# EAGLE design PCB eagle project (EAGLE 7.7.0)
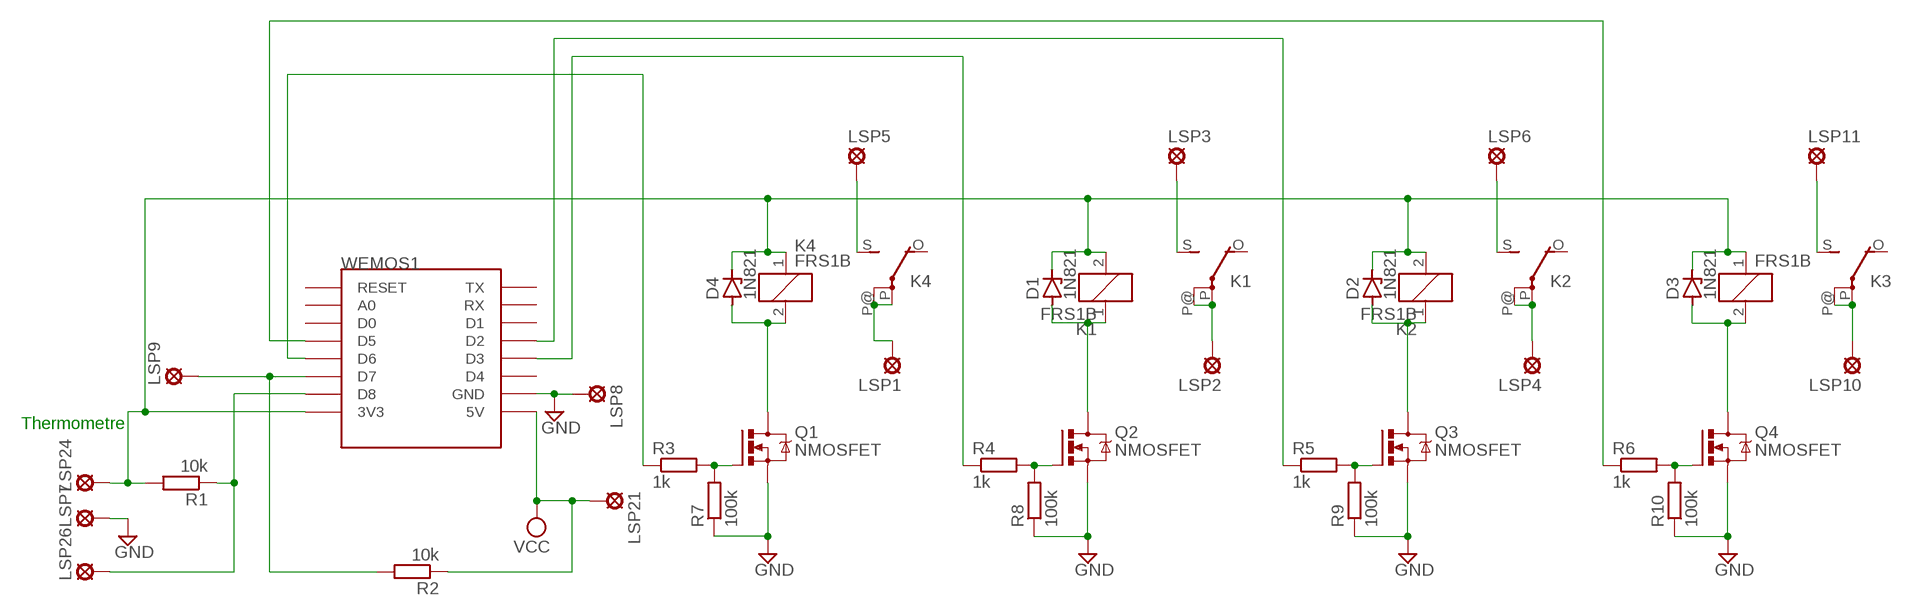
[diagram p0: schematic, sheet 1]

## Parts
D1  1N821  [DO35Z10]
D2  1N821  [DO35Z10]
D3  1N821  [DO35Z10]
D4  1N821  [DO35Z10]
K1  FRS1B  [FRS1B]
K2  FRS1B  [FRS1B]
K3  FRS1B  [FRS1B]
K4  FRS1B  [FRS1B]
LSP1  MCS10B  [MCS10B]
LSP2  MCS10B  [MCS10B]
LSP3  MCS10B  [MCS10B]
LSP4  MCS10B  [MCS10B]
LSP5  MCS10B  [MCS10B]
LSP6  MCS10B  [MCS10B]
LSP7  MCS10B  [MCS10B]
LSP8  MCS10B  [MCS10B]
LSP9  MCS10B  [MCS10B]
LSP10  MCS10B  [MCS10B]
LSP11  MCS10B  [MCS10B]
LSP21  MCS10B  [MCS10B]
LSP24  MCS10B  [MCS10B]
LSP26  MCS10B  [MCS10B]
Q1  NMOSFET  NMOSFETSOT23-GSD  [SOT23]
Q2  NMOSFET  NMOSFETSOT23-GSD  [SOT23]
Q3  NMOSFET  NMOSFETSOT23-GSD  [SOT23]
Q4  NMOSFET  NMOSFETSOT23-GSD  [SOT23]
R1  10k  R-EU_0207/10  [0207/10]
R2  10k  R-EU_0207/10  [0207/10]
R3  1k  R-EU_0207/10  [0207/10]
R4  1k  R-EU_0207/10  [0207/10]
R5  1k  R-EU_0207/10  [0207/10]
R6  1k  R-EU_0207/10  [0207/10]
R7  100k  R-EU_0207/10  [0207/10]
R8  100k  R-EU_0207/10  [0207/10]
R9  100k  R-EU_0207/10  [0207/10]
R10  100k  R-EU_0207/10  [0207/10]
WEMOS1  ui  WEMOS-D1-MINI  [WEMOS-D1-MINI]

## Nets
GND: LSP7.MP LSP8.MP Q1.2(S) Q2.2(S) Q3.2(S) Q4.2(S) R7.1 R8.1 R9.1 R10.1 WEMOS1.GND
N$1: K4.S(2:S) LSP5.MP
N$3: K3.S(2:S) LSP11.MP
N$4: K1.S(2:S) LSP3.MP
N$5: K4.P(2:P) K4.P@(2:P) LSP1.MP
N$7: K1.P(2:P) K1.P@(2:P) LSP2.MP
N$8: LSP26.MP R1.1 WEMOS1.D8
N$10: K2.S(2:S) LSP6.MP
N$11: LSP9.MP R2.2 WEMOS1.D7
N$12: K2.P(2:P) K2.P@(2:P) LSP4.MP
N$13: K3.P(2:P) K3.P@(2:P) LSP10.MP
N$15: D1.C D2.C D3.C D4.C K1.2 K2.2 K3.1 K4.1 LSP24.MP R1.2 WEMOS1.3V3
N$16: D4.A K4.2 Q1.3(D)
N$18: D1.A K1.1 Q2.3(D)
N$19: D2.A K2.1 Q3.3(D)
N$20: D3.A K3.2 Q4.3(D)
N$21: Q1.1(G) R3.2 R7.2
N$23: Q2.1(G) R4.2 R8.2
N$24: Q3.1(G) R5.2 R9.2
N$25: Q4.1(G) R6.2 R10.2
N$26: R3.1 WEMOS1.D6
N$27: R4.1 WEMOS1.D3
N$28: R5.1 WEMOS1.D2
N$29: R6.1 WEMOS1.D5
VCC: LSP21.MP R2.1 WEMOS1.5V
Unconnected: K1.O(2:O) K2.O(2:O) K3.O(2:O) K4.O(2:O) WEMOS1.A0 WEMOS1.D0 WEMOS1.D1 WEMOS1.D4 WEMOS1.RESET WEMOS1.RX WEMOS1.TX

## Notes on the sheet
- Thermometre

## Library data of the parts
D1-D4 = diode:1N821: Reference DIODE temperature compensated, 6,2 V
K1-K4 = relay:FRS1B: RELAY 1 x switch, same as V23101-D6-A201, Siemens; OC_FARNELL: unknown; OC_NEWARK: unknown
LSP1-LSP11 LSP21 LSP24 LSP26 = solpad_gropad:MCS10B: SOLDER PAD MC S1, distributor Buerklin, 15F505
Q1-Q4 = Transistor:NMOSFET: N-Channel MOSFET - Generic; CATEGORY: Transistor; SUB-CATEGORY: MOSFET; TYPE: N-Channel
R1-R10 = rcl_gropad:R-EU_: RESISTOR, European symbol; SPICEPREFIX: R
WEMOS1 = esp8266modules:WEMOS-D1-MINI: WeMos.cc D1 mini ESP8266 module

## Net classes
0 default: clearance 0.205 mm

## Board
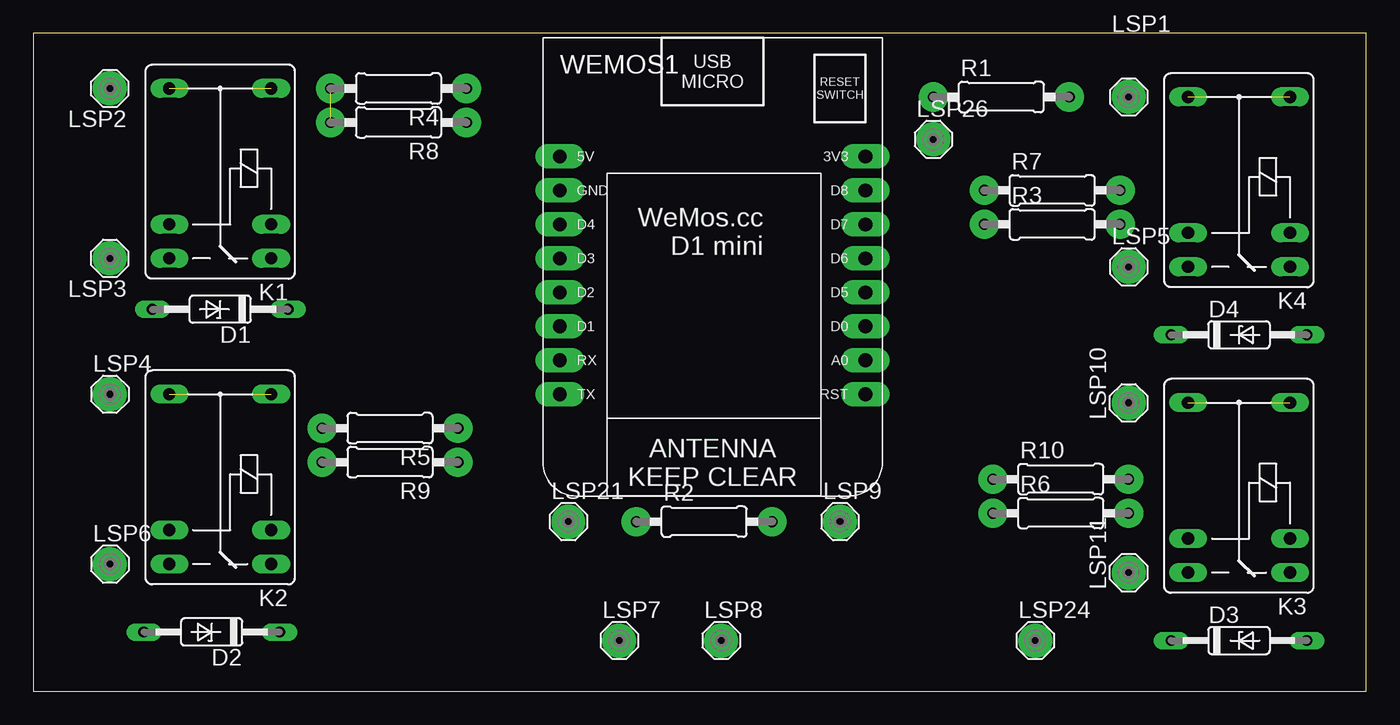
[diagram p1: board, top side]
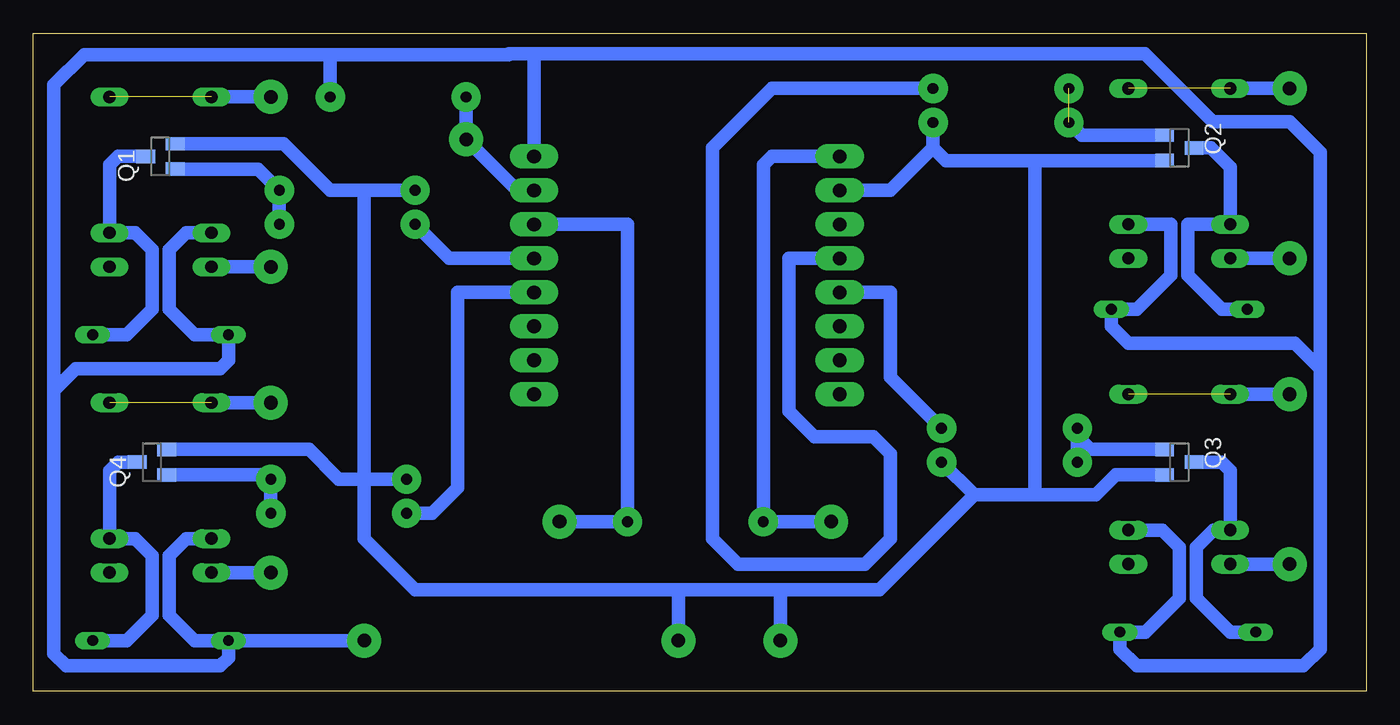
[diagram p2: board, bottom side, seen from below]

Size 99.67 x 49.2 mm. Coordinates in mm from the lower left corner, seen from the top.
Outline: 0,0 99.67,0 99.67,49.2 0,49.2 0,0
Copper layers (1*16): Top 0.035mm / dielectric 1.5mm / Bottom 0.035mm
Design rules "default": minimum track width 6mil, minimum drill 0.35mm, track to track 6mil, track to pad 6mil, pad to pad 6mil, via to via 6mil, smd to smd 6mil, copper to edge 40mil, drill to drill 6mil, minimum pad ring 10mil, minimum via ring 8mil, stop-mask expansion 4mil, vias tented up to drill 0mil, thermal gap 10mil

### Footprints (pad centres in the part's own frame; a part is rotated, then mirrored left to right if it is on the bottom)
DO35Z10 = drill 0.813 long: A 5.08,0; C -5.08,0
FRS1B = drill 0.914 long: 1 0,3.81; 2 0,-3.81; O -2.54,-3.81; P 10.16,3.81; P@ 10.16,-3.81; S -2.54,3.81
MCS10B = drill 1.016 pad 2.54: MP 0,0
SOT23 = smd 1 x 1.4: 1 -0.95,-1.1; 2 0.95,-1.1; 3 0,1.1
0207/10 = drill 0.813 pad 2.184: 1 -5.08,0; 2 5.08,0
WEMOS-D1-MINI = drill 1.016 pad 1.829 long: 3V3 -10.16,-10.16; 5V 12.7,-10.16; A0 -10.16,5.08; D0 -10.16,2.54; D1 12.7,2.54; D2 12.7,0; D3 12.7,-2.54; D4 12.7,-5.08; D5 -10.16,0; D6 -10.16,-2.54; D7 -10.16,-5.08; D8 -10.16,-7.62; GND 12.7,-7.62; RESET -10.16,7.62; RX 12.7,5.08; TX 12.7,7.62

### Placement (x,y rotation side)
D1  13.97,28.57 180 top
D2  13.34,4.45 180 top
D3  90.17,3.81 0 top
D4  90.17,26.67 0 top
K1  13.97,34.92 90 top
K2  13.97,12.06 90 top
K3  90.17,11.43 90 top
K4  90.17,34.29 90 top
LSP1  81.92,44.45 0 top
LSP2  5.71,45.09 180 top
LSP3  5.71,32.38 180 top
LSP4  5.71,22.23 0 top
LSP5  81.92,31.75 0 top
LSP6  5.71,9.53 0 top
LSP7  43.81,3.81 0 top
LSP8  51.44,3.81 0 top
LSP9  60.33,12.7 0 top
LSP10  81.92,21.59 90 top
LSP11  81.92,8.89 90 top
LSP21  40.01,12.7 0 top
LSP24  74.93,3.81 0 top
LSP26  67.31,41.27 0 top
Q1  90.17,40.01 90 bottom
Q2  13.97,40.64 270 bottom
Q3  13.97,17.14 270 bottom
Q4  90.81,17.14 90 bottom
R1  72.39,44.45 0 top
R2  50.16,12.7 0 top
R3  76.2,34.92 0 top
R4  27.3,45.09 180 top
R5  26.67,19.68 180 top
R6  76.83,13.34 0 top
R7  76.2,37.47 0 top
R8  27.3,42.55 180 top
R9  26.67,17.14 180 top
R10  76.83,15.88 0 top
WEMOS1  52.07,29.84 180 top

### Tracks (layer width: path | path; a pad name or v marks a point on that pad's centre or on a via)
GND
  Bottom 1.016: Q3.2 18.72,16.2 20.21,14.71 24.77,14.71 | 24.77,14.71 29.31,14.71 | 29.31,14.71 R9.1 | R8.1 32.38,40.64 | 32.38,40.64 31.43,39.69 24.77,39.69 | 24.77,39.69 Q2.2 | 24.77,39.69 24.77,14.71 | 32.38,40.64 35.56,37.47 WEMOS1.GND | Q4.2 79.06,18.09 76.83,15.88 74.93,15.88 | 74.93,15.88 R10.1 | Q1.2 80.96,40.95 77.47,37.47 74.93,37.47 | 74.93,37.47 R7.1 | 74.93,15.88 74.93,37.47 | 74.93,15.88 74.93,11.43 71.12,7.62 51.44,7.62 | 51.44,7.62 43.81,7.62 | 43.81,7.62 36.4,7.62 29.31,14.71 | LSP7.MP 43.81,7.62 | LSP8.MP 51.44,7.62
N$1
  Bottom 1.016: LSP5.MP K4.S
N$3
  Bottom 1.016: LSP11.MP K3.S
N$4
  Bottom 1.016: K1.S LSP3.MP
N$5  (1 unrouted)
  Bottom 1.016: LSP1.MP K4.P
N$7  (1 unrouted)
  Bottom 1.016: K1.P LSP2.MP
N$8
  Bottom 1.016: R1.1 LSP26.MP 63.5,37.47 WEMOS1.D8
N$10
  Bottom 1.016: LSP6.MP K2.S
N$11
  Bottom 1.016: WEMOS1.D7 55.24,34.92 R2.2 LSP9.MP
N$12  (1 unrouted)
  Bottom 1.016: LSP4.MP K2.P
N$13  (1 unrouted)
  Bottom 1.016: LSP10.MP K3.P
N$15
  Bottom 1.016: K2.2 15.24,12.06 13.97,10.79 13.97,6.99 16.51,4.45 D2.C 18.41,3.17 17.14,1.91 4.7,1.91 3.43,3.17 3.43,24.13 | K1.2 14.61,34.92 14.61,31.11 17.14,28.57 D1.C 19.05,27.3 17.78,26.04 5.33,26.04 3.43,24.13 | K4.1 88.27,34.29 89.53,33.02 89.53,28.57 87.63,26.67 D4.C 85.09,24.77 85.72,24.13 96.52,24.13 98.15,22.5 | D3.C 87.63,3.81 89.53,5.71 89.53,10.16 88.27,11.43 K3.1 | 98.15,22.5 98.15,2.84 97.22,1.91 85.72,1.91 85.09,2.54 D3.C | 98.15,22.5 98.15,45.36 95.89,47.62 77.47,47.62 | 77.47,47.62 64.14,47.62 64.08,47.68 62.23,47.68 | 3.43,24.13 3.43,40.31 5.71,42.6 11.48,42.6 16.56,47.68 62.23,47.68 | D3.C LSP24.MP | WEMOS1.3V3 62.23,47.68 | R1.2 77.47,47.62
N$16
  Bottom 1.016: D4.A 92.71,26.67 90.81,28.57 90.81,33.02 92.08,34.29 K4.2 93.98,39.37 93.34,40.01 Q1.3
N$18
  Bottom 1.016: D1.A 10.79,28.57 13.34,31.11 13.34,34.92 K1.1 10.16,39.2 11.6,40.64 Q2.3
N$19
  Bottom 1.016: D2.A 10.16,4.45 12.7,6.99 12.7,10.79 11.43,12.06 K2.1 10.16,16.51 10.79,17.14 Q3.3
N$20
  Bottom 1.016: D3.A 92.71,3.81 90.81,5.71 90.81,10.16 92.08,11.43 K3.2 93.98,16.51 93.34,17.14 Q4.3
N$21
  Bottom 1.016: R3.2 R7.2 82.87,39.05 Q1.1
N$23  (1 unrouted)
  Bottom 1.016: R8.2 21.27,41.59 Q2.1
N$24
  Bottom 1.016: Q3.1 20.64,18.09 21.59,19.05 R5.2 R9.2
N$25
  Bottom 1.016: R6.2 R10.2 82.23,16.2 Q4.1
N$26
  Bottom 1.016: R3.1 68.58,32.38 WEMOS1.D6
N$27
  Bottom 1.016: R4.1 44.45,45.09 48.9,40.64 48.9,11.43 46.99,9.53 37.47,9.53 35.56,11.43 35.56,17.78 36.83,19.05 41.27,19.05 43.18,20.95 43.18,32.38 WEMOS1.D3
N$28
  Bottom 1.016: R5.1 35.56,23.5 35.56,29.84 WEMOS1.D2
N$29
  Bottom 1.016: R6.1 69.85,13.34 67.94,15.24 67.94,29.84 WEMOS1.D5
VCC
  Bottom 1.016: WEMOS1.5V 44.45,40.01 45.09,39.37 R2.1 LSP21.MP